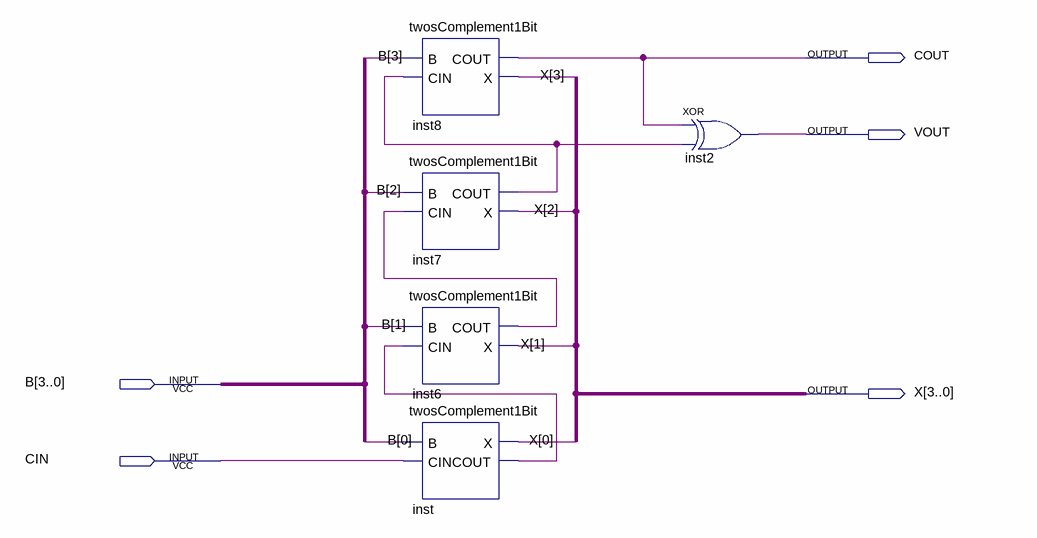
[diagram p0: schematic sheet]
// Quartus schematic twosComplement4Bit_overflow.bdf as structural Verilog: 5 symbols, 5 pins
module twosComplement4Bit_overflow (
  input  [3:0] B,
  input  CIN,
  output COUT,
  output VOUT,
  output [3:0] X
);

  wire inst6_cout, inst7_cout, inst_cout;

  twosComplement1Bit inst8 (.B(B[3]), .CIN(inst7_cout), .COUT(COUT), .X(X[3]));
  twosComplement1Bit inst7 (.B(B[2]), .CIN(inst6_cout), .COUT(inst7_cout), .X(X[2]));
  twosComplement1Bit inst6 (.B(B[1]), .CIN(inst_cout), .COUT(inst6_cout), .X(X[1]));
  twosComplement1Bit inst (.B(B[0]), .CIN(CIN), .X(X[0]), .COUT(inst_cout));
  xor inst2 (VOUT, COUT, inst7_cout);
endmodule
